# EAGLE schematic shield_confortimetro_bia (EAGLE 7.7.0)
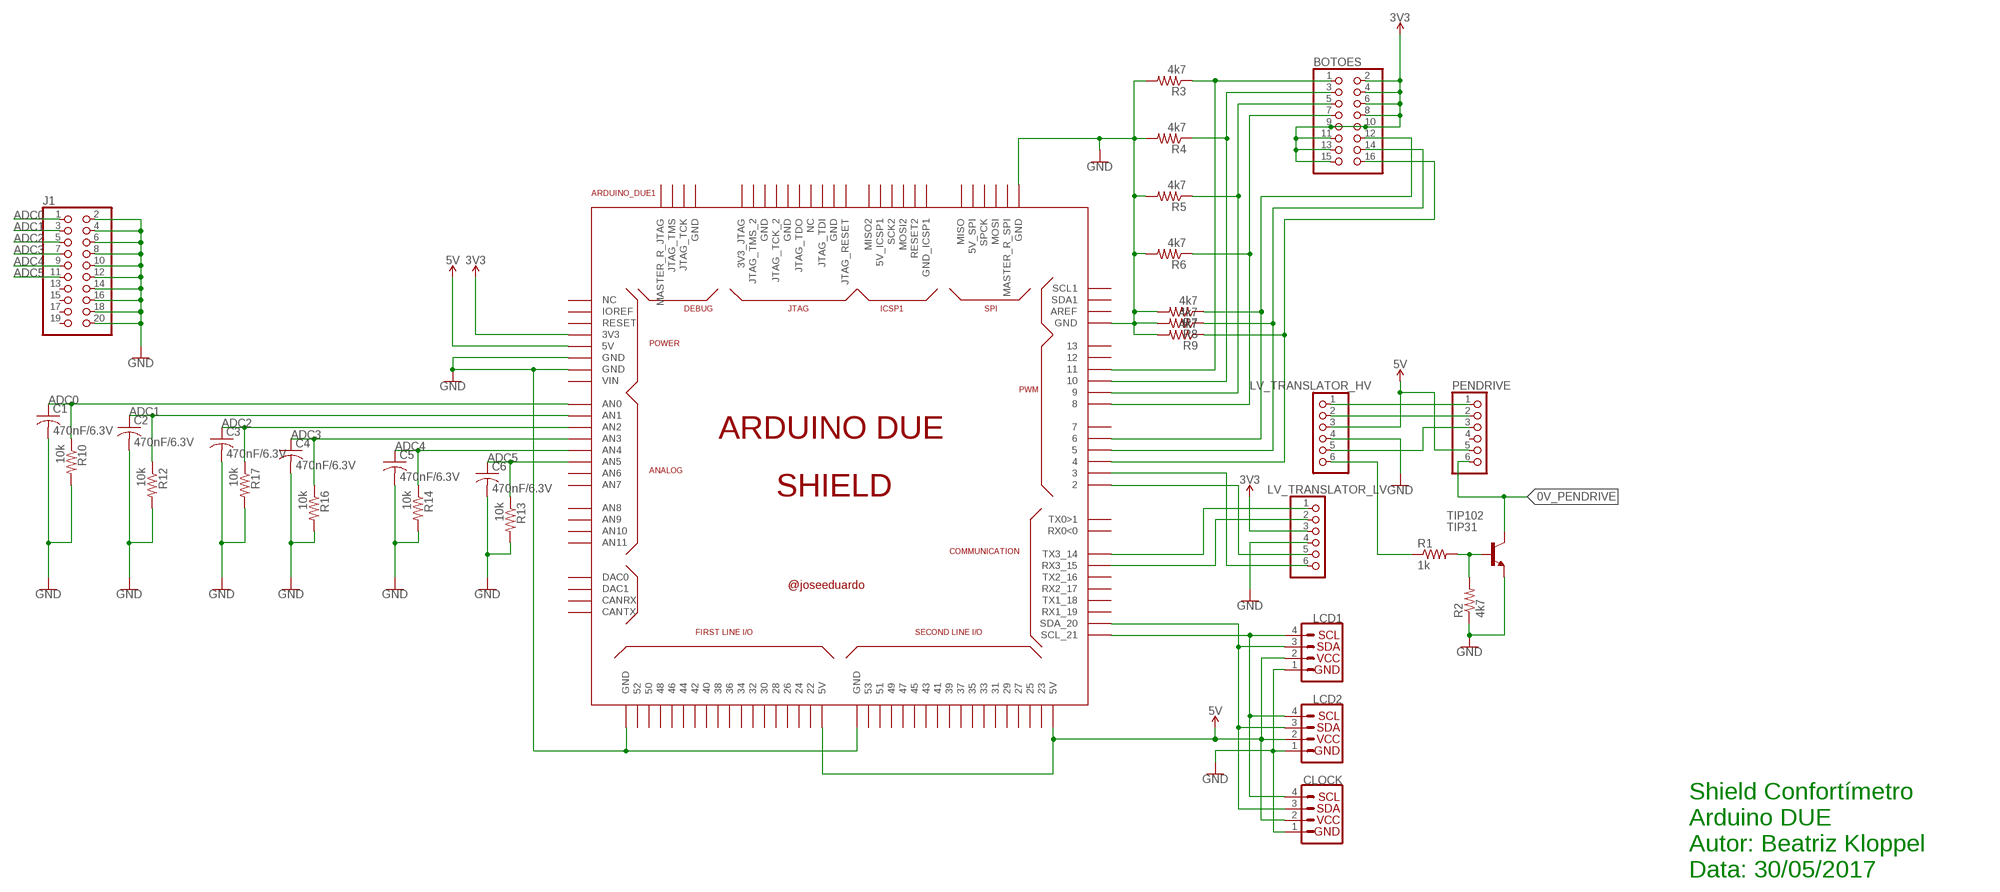
[diagram p0: schematic, sheet 1]

## Parts
ARDUINO_DUE1  ARDUINO_DUE_SHIELD  [ARDUINO_DUE_SHIELD]
BOTOES  PINHD-2X8  [2X08]
C1  470nF/6.3V  C-US050-030X075  [C050-030X075]
C2  470nF/6.3V  C-US050-030X075  [C050-030X075]
C3  470nF/6.3V  C-US050-030X075  [C050-030X075]
C4  470nF/6.3V  C-US050-030X075  [C050-030X075]
C5  470nF/6.3V  C-US050-030X075  [C050-030X075]
C6  470nF/6.3V  C-US050-030X075  [C050-030X075]
CLOCK  I2C_STANDARD  [1X04]
J1  PINHD-2X10  [2X10]
LCD1  I2C_STANDARD  [1X04]
LCD2  I2C_STANDARD  [1X04]
LV_TRANSLATOR_HV  PINHD-1X6  [1X06]
LV_TRANSLATOR_LV  PINHD-1X6  [1X06]
PENDRIVE  PINHD-1X6  [1X06]
R1  1k  R-US_0309/12  [0309/12]
R2  4k7  R-US_0309/12  [0309/12]
R3  4k7  R-US_0309/12  [0309/12]
R4  4k7  R-US_0309/12  [0309/12]
R5  4k7  R-US_0309/12  [0309/12]
R6  4k7  R-US_0309/12  [0309/12]
R7  4k7  R-US_0309/12  [0309/12]
R8  4k7  R-US_0309/12  [0309/12]
R9  4k7  R-US_0309/12  [0309/12]
R10  10k  R-US_0309/12  [0309/12]
R12  10k  R-US_0309/12  [0309/12]
R13  10k  R-US_0309/12  [0309/12]
R14  10k  R-US_0309/12  [0309/12]
R16  10k  R-US_0309/12  [0309/12]
R17  10k  R-US_0309/12  [0309/12]
TIP102  TIP31  [TO220]

## Nets
0V_PENDRIVE: PENDRIVE.6 TIP102.2(C)
ADC0: ARDUINO_DUE1.A0(AN0) C1.1 J1.1 R10.1
ADC1: ARDUINO_DUE1.A1(AN1) C2.1 J1.3 R12.1
ADC2: ARDUINO_DUE1.A2(AN2) C3.1 J1.5 R17.1
ADC3: ARDUINO_DUE1.A3(AN3) C4.1 J1.7 R16.1
ADC4: ARDUINO_DUE1.A4(AN4) C5.1 J1.9 R14.1
ADC5: ARDUINO_DUE1.A5(AN5) C6.1 J1.11 R13.1
GND: ARDUINO_DUE1.GND ARDUINO_DUE1.GND_1(GND) ARDUINO_DUE1.GND_2(GND) ARDUINO_DUE1.GND_3(GND) ARDUINO_DUE1.GND_4(GND) ARDUINO_DUE1.GND_5(GND) C1.2 C2.2 C3.2 C4.2 C5.2 C6.2 CLOCK.1 J1.2 J1.4 J1.6 J1.8 J1.10 J1.12 J1.14 J1.16 J1.18 J1.20 LCD1.1 LCD2.1 LV_TRANSLATOR_HV.4 LV_TRANSLATOR_LV.4 R2.1 R3.2 R4.2 R5.2 R6.2 R7.2 R8.2 R9.2 R10.2 R12.2 R13.2 R14.2 R16.2 R17.2 TIP102.3(E)
N$1: ARDUINO_DUE1.20(SDA_20) CLOCK.3 LCD1.3 LCD2.3
N$2: ARDUINO_DUE1.21(SCL_21) CLOCK.4 LCD1.4 LCD2.4
N$3: ARDUINO_DUE1.14(TX3_14) LV_TRANSLATOR_LV.1
N$4: ARDUINO_DUE1.15(RX3_15) LV_TRANSLATOR_LV.2
N$5: ARDUINO_DUE1.3 LV_TRANSLATOR_LV.6
N$6: ARDUINO_DUE1.2 LV_TRANSLATOR_LV.5
N$7: LV_TRANSLATOR_HV.1 PENDRIVE.1
N$8: LV_TRANSLATOR_HV.2 PENDRIVE.2
N$9: LV_TRANSLATOR_HV.5 PENDRIVE.3
N$10: R1.2 R2.2 TIP102.1(B)
N$11: LV_TRANSLATOR_HV.6 R1.1
N$12: ARDUINO_DUE1.6 BOTOES.12 R7.1
N$13: ARDUINO_DUE1.5 BOTOES.14 R8.1
N$14: ARDUINO_DUE1.4 BOTOES.16 R9.1
N$15: ARDUINO_DUE1.8 BOTOES.7 R6.1
N$16: ARDUINO_DUE1.9 BOTOES.5 R5.1
N$17: ARDUINO_DUE1.10 BOTOES.3 R4.1
N$18: ARDUINO_DUE1.11 BOTOES.1 R3.1
VCC_3V3: ARDUINO_DUE1.3V3 BOTOES.2 BOTOES.4 BOTOES.6 BOTOES.8 BOTOES.9 BOTOES.10 BOTOES.11 BOTOES.13 BOTOES.15 LV_TRANSLATOR_LV.3 ; supply symbol labelled 3V3
VCC_5V: ARDUINO_DUE1.5V0(5V) ARDUINO_DUE1.5V0_1(5V) ARDUINO_DUE1.5V0_2(5V) CLOCK.2 LCD1.2 LCD2.2 LV_TRANSLATOR_HV.3 PENDRIVE.5 ; supply symbol labelled 5V
Unconnected: ARDUINO_DUE1.0(RX0<0) ARDUINO_DUE1.1(TX0>1) ARDUINO_DUE1.3V3_JTAG ARDUINO_DUE1.5V_2(5V_SPI) ARDUINO_DUE1.5V_ICSP1 ARDUINO_DUE1.7 ARDUINO_DUE1.12 ARDUINO_DUE1.13 ARDUINO_DUE1.16(TX2_16) ARDUINO_DUE1.17(RX2_17) ARDUINO_DUE1.18(TX1_18) ARDUINO_DUE1.19(RX1_19) ARDUINO_DUE1.22 ARDUINO_DUE1.23 ARDUINO_DUE1.24 ARDUINO_DUE1.25 ARDUINO_DUE1.26 ARDUINO_DUE1.27 ARDUINO_DUE1.28 ARDUINO_DUE1.29 ARDUINO_DUE1.30 ARDUINO_DUE1.31 ARDUINO_DUE1.32 ARDUINO_DUE1.33 ARDUINO_DUE1.34 ARDUINO_DUE1.35 ARDUINO_DUE1.36 ARDUINO_DUE1.37 ARDUINO_DUE1.38 ARDUINO_DUE1.39 ARDUINO_DUE1.40 ARDUINO_DUE1.41 ARDUINO_DUE1.42 ARDUINO_DUE1.43 ARDUINO_DUE1.44 ARDUINO_DUE1.45 ARDUINO_DUE1.46 ARDUINO_DUE1.47 ARDUINO_DUE1.48 ARDUINO_DUE1.49 ARDUINO_DUE1.50 ARDUINO_DUE1.51 ARDUINO_DUE1.52 ARDUINO_DUE1.53 ARDUINO_DUE1.A6(AN6) ARDUINO_DUE1.A7(AN7) ARDUINO_DUE1.A8(AN8) ARDUINO_DUE1.A9(AN9) ARDUINO_DUE1.A10(AN10) ARDUINO_DUE1.A11(AN11) ARDUINO_DUE1.AREF ARDUINO_DUE1.CANRX ARDUINO_DUE1.CANTX ARDUINO_DUE1.DAC0 ARDUINO_DUE1.DAC1 ARDUINO_DUE1.GND_7(GND) ARDUINO_DUE1.GND_8(GND) ARDUINO_DUE1.GND_9(GND) ARDUINO_DUE1.GND_10(GND) ARDUINO_DUE1.GND_ICSP1 ARDUINO_DUE1.IOREF ARDUINO_DUE1.JTAG_RESET ARDUINO_DUE1.JTAG_TCK ARDUINO_DUE1.JTAG_TCK_2 ARDUINO_DUE1.JTAG_TDI ARDUINO_DUE1.JTAG_TDO ARDUINO_DUE1.JTAG_TMS ARDUINO_DUE1.JTAG_TMS_2 ARDUINO_DUE1.MASTER_RESET_JTAG(MASTER_R_JTAG) ARDUINO_DUE1.MASTER_RESET_SPI(MASTER_R_SPI) ARDUINO_DUE1.MISO ARDUINO_DUE1.MISO2 ARDUINO_DUE1.MOSI ARDUINO_DUE1.MOSI2 ARDUINO_DUE1.NC_2(NC) ARDUINO_DUE1.NC_5(NC) ARDUINO_DUE1.RESET ARDUINO_DUE1.RESET2 ARDUINO_DUE1.SCK2 ARDUINO_DUE1.SCL1 ARDUINO_DUE1.SDA1 ARDUINO_DUE1.SPCK ARDUINO_DUE1.VIN J1.13 J1.15 J1.17 J1.19 PENDRIVE.4

## Notes on the sheet
- Shield Confortímetro 
  Arduino DUE
  Autor: Beatriz Kloppel
  Data: 30/05/2017

## Library data of the parts
ARDUINO_DUE1 = arduino_due_shield:ARDUINO_DUE_SHIELD
BOTOES = pinhead:PINHD-2X8: PIN HEADER
C1-C6 = adafruit:C-US: CAPACITOR, American symbol
CLOCK LCD1 LCD2 = SparkFun-Connectors:I2C_STANDARD: SparkFun I2C Standard Pinout Header SparkFun has standardized on a pinout for all I2C based sensor breakouts. This pinout allows I2C boards to be plugged directly into the headers on Arduino Uno compatible boards, and to be daisy chained easily. Example SparkFun Products: SparkFun Atmospheric Sensor Breakout - BME280 <https://www.sparkfun.com/products/13676> SparkFun Altitude/Pressure Sensor Breakout - MPL3115A2 <https://www.sparkfun.com/products/11084> SparkFun TOF Range Finder Sensor - VL6180 <https://www.sparkfun.com/products/12785>
J1 = SparkFun-Retired:PINHD-2X10: PIN HEADER
LV_TRANSLATOR_HV LV_TRANSLATOR_LV PENDRIVE = adafruit:PINHD-1X6: PIN HEADER
R1-R10 R12-R14 R16 R17 = adafruit:R-US_: RESISTOR, American symbol
TIP102 = transistor:TIP31: NPN Transistor Medium Power Linear Switching Applications Source: http://onsemi.com